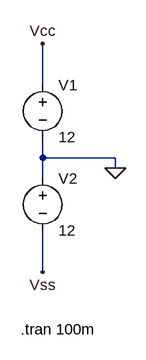
[diagram p0: schematic Draft3.asc]
Draft3.asc, the LTspice schematic file:
Version 4
SHEET 1 880 680
WIRE 96 112 96 48
WIRE 96 224 96 192
WIRE 208 224 96 224
WIRE 208 240 208 224
WIRE 96 256 96 224
WIRE 96 400 96 336
FLAG 208 240 0
FLAG 96 48 Vcc
FLAG 96 400 Vss
SYMBOL voltage 96 96 R0
WINDOW 123 0 0 Left 0
WINDOW 39 0 0 Left 0
SYMATTR InstName V1
SYMATTR Value 12
SYMBOL voltage 96 240 R0
WINDOW 123 0 0 Left 0
WINDOW 39 0 0 Left 0
SYMATTR InstName V2
SYMATTR Value 12
TEXT 62 488 Left 2 !.tran 100m

The netlist it stands for:
* Draft3.asc
V1 Vcc 0 12
V2 0 Vss 12
.tran 100m
.backanno
.end